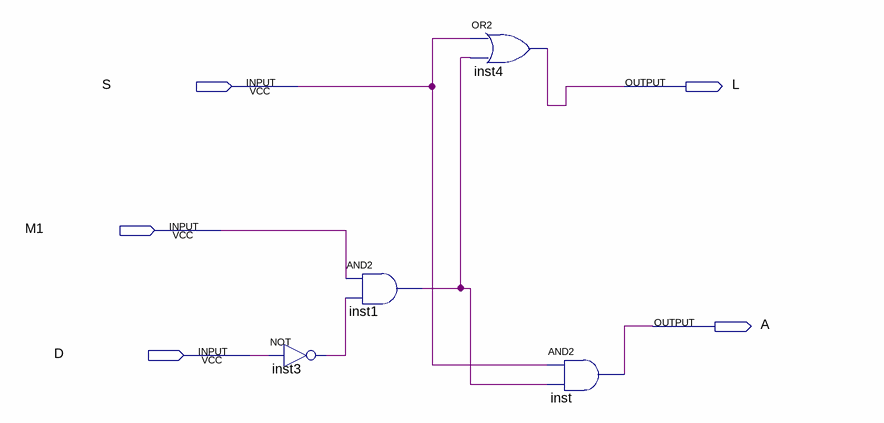
[diagram p0: schematic sheet]
// Quartus schematic Lab2.bdf as structural Verilog: 4 symbols, 5 pins
module Lab2 (
  input  S,
  input  M1,
  input  D,
  output L,
  output A
);

  wire inst1_out, inst3_out;

  not inst3 (inst3_out, D);
  and inst1 (inst1_out, M1, inst3_out);
  or inst4 (L, S, inst1_out);
  and inst (A, S, inst1_out);
endmodule
